# Altium schematic sheet Voltage_sensor_UVW.SchDoc
size 381 x 457 mm
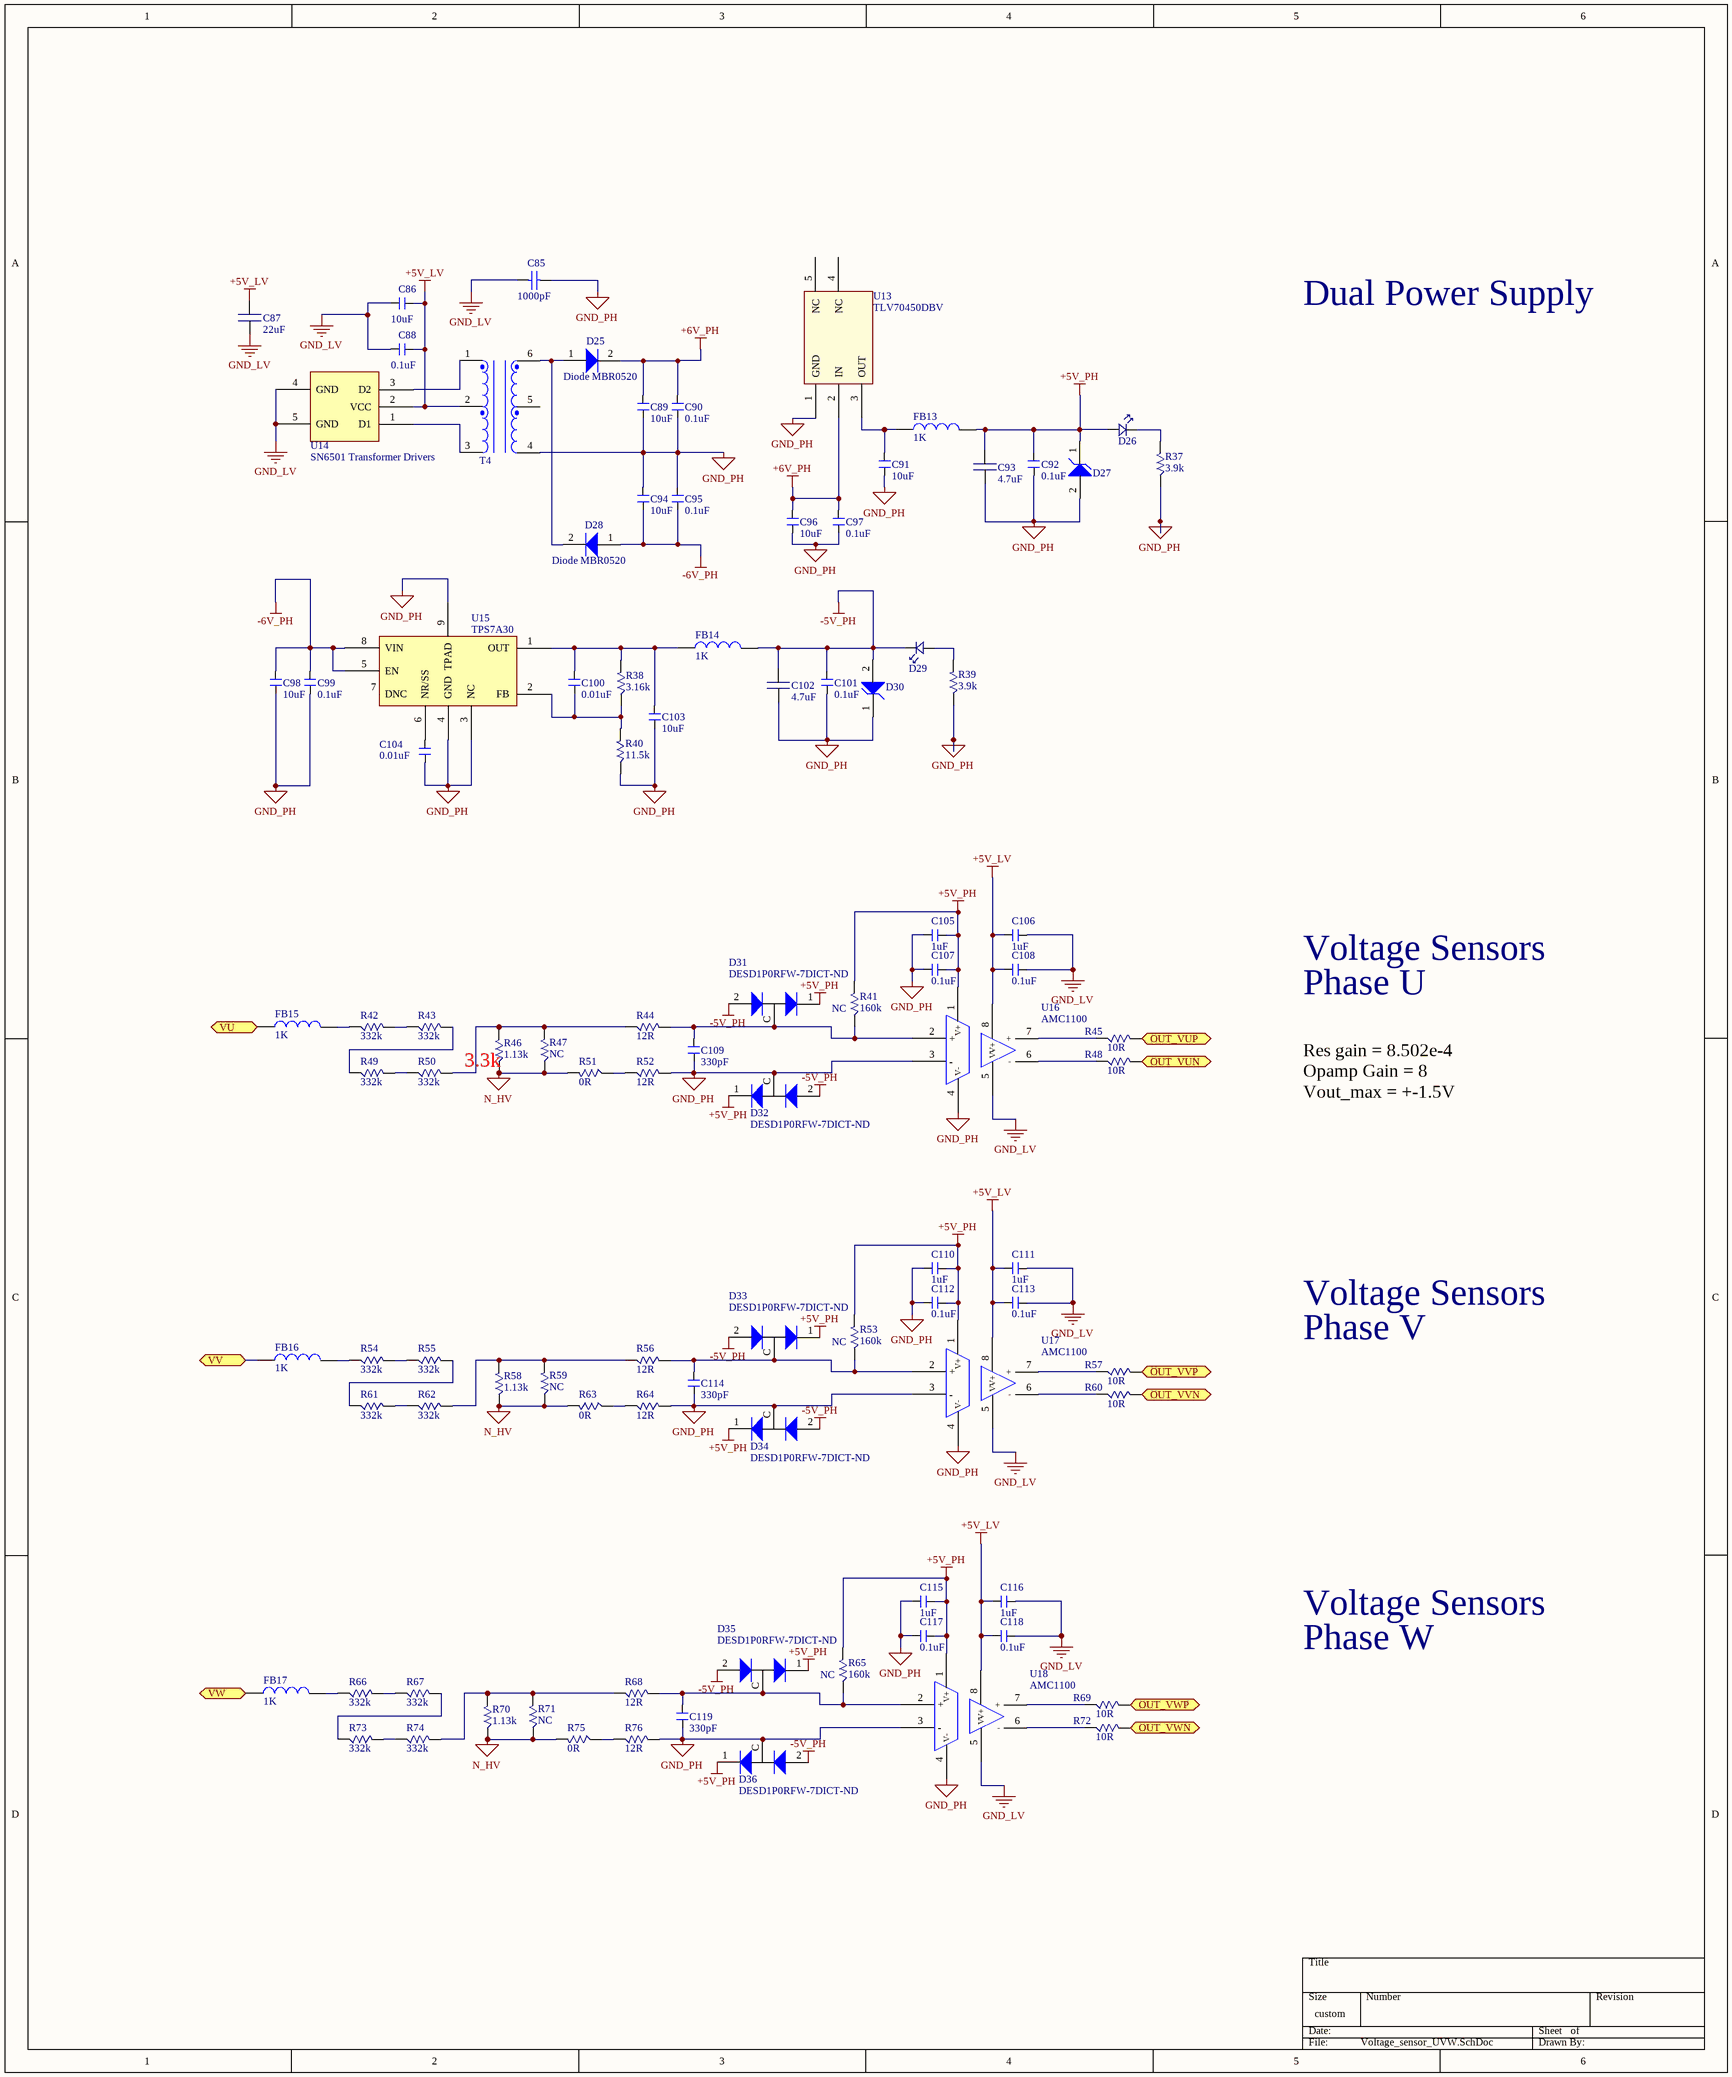
[diagram p0: Voltage_sensor_UVW.SchDoc]

## Parts
C85  value 1000pF  [RAD-0.3]  (hidden comment: Cap TH)
C86  value 10uF  [0603 (1608 Metric)]  (hidden comment: Cap 0603_new)
C87  value 22uF  [0805 (2012 metric)]  (hidden comment: Cap 0805)
C88  value 0.1uF  [0603 (1608 Metric)]  (hidden comment: Cap 0603_new)
C89  value 10uF  [0603 (1608 Metric)]  (hidden comment: Cap 0603_new)
C90  value 0.1uF  [0603 (1608 Metric)]  (hidden comment: Cap 0603_new)
C91  value 10uF  [0603 (1608 Metric)]  (hidden comment: Cap 0603_new)
C92  value 0.1uF  [0603 (1608 Metric)]  (hidden comment: Cap 0603_new)
C93  value 4.7uF  [0805 (2012 metric)]  (hidden comment: Cap 0805)
C94  value 10uF  [0603 (1608 Metric)]  (hidden comment: Cap 0603_new)
C95  value 0.1uF  [0603 (1608 Metric)]  (hidden comment: Cap 0603_new)
C96  value 10uF  [0603 (1608 Metric)]  (hidden comment: Cap 0603_new)
C97  value 0.1uF  [0603 (1608 Metric)]  (hidden comment: Cap 0603_new)
C98  value 10uF  [0603 (1608 Metric)]  (hidden comment: Cap 0603_new)
C99  value 0.1uF  [0603 (1608 Metric)]  (hidden comment: Cap 0603_new)
C100  value 0.01uF  [0603 (1608 Metric)]  (hidden comment: Cap 0603_new)
C101  value 0.1uF  [0603 (1608 Metric)]  (hidden comment: Cap 0603_new)
C102  value 4.7uF  [0805 (2012 metric)]  (hidden comment: Cap 0805)
C103  value 10uF  [0603 (1608 Metric)]  (hidden comment: Cap 0603_new)
C104  value 0.01uF  [0603 (1608 Metric)]  (hidden comment: Cap 0603_new)
C105  value 1uF  [0603 (1608 Metric)]  (hidden comment: Cap 0603_new)
C106  value 1uF  [0603 (1608 Metric)]  (hidden comment: Cap 0603_new)
C107  value 0.1uF  [0603 (1608 Metric)]  (hidden comment: Cap 0603_new)
C108  value 0.1uF  [0603 (1608 Metric)]  (hidden comment: Cap 0603_new)
C109  value 330pF  [0603 (1608 Metric)]  (hidden comment: Cap 0603_new)
C110  value 1uF  [0603 (1608 Metric)]  (hidden comment: Cap 0603_new)
C111  value 1uF  [0603 (1608 Metric)]  (hidden comment: Cap 0603_new)
C112  value 0.1uF  [0603 (1608 Metric)]  (hidden comment: Cap 0603_new)
C113  value 0.1uF  [0603 (1608 Metric)]  (hidden comment: Cap 0603_new)
C114  value 330pF  [0603 (1608 Metric)]  (hidden comment: Cap 0603_new)
C115  value 1uF  [0603 (1608 Metric)]  (hidden comment: Cap 0603_new)
C116  value 1uF  [0603 (1608 Metric)]  (hidden comment: Cap 0603_new)
C117  value 0.1uF  [0603 (1608 Metric)]  (hidden comment: Cap 0603_new)
C118  value 0.1uF  [0603 (1608 Metric)]  (hidden comment: Cap 0603_new)
C119  value 330pF  [0603 (1608 Metric)]  (hidden comment: Cap 0603_new)
D25  Diode MBR0520  [SOD-123]
D26  LED  [0805 (2012 Metric) Diode]  (value not drawn)
D27  *  [POWERDI]  (value not drawn)
D28  Diode MBR0520  [SOD-123]
D29  LED  [0805 (2012 Metric) Diode]  (value not drawn)
D30  *  [POWERDI]  (value not drawn)
D31  Part: DESD1P0RFW-7DICT-ND  [SOT323_ESD]  (hidden comment: TVS - Diodes)
D32  Part: DESD1P0RFW-7DICT-ND  [SOT323_ESD]  (hidden comment: TVS - Diodes)
D33  Part: DESD1P0RFW-7DICT-ND  [SOT323_ESD]  (hidden comment: TVS - Diodes)
D34  Part: DESD1P0RFW-7DICT-ND  [SOT323_ESD]  (hidden comment: TVS - Diodes)
D35  Part: DESD1P0RFW-7DICT-ND  [SOT323_ESD]  (hidden comment: TVS - Diodes)
D36  Part: DESD1P0RFW-7DICT-ND  [SOT323_ESD]  (hidden comment: TVS - Diodes)
FB13  value 1K  [0603 (1608 Metric)]  (hidden comment: Ferrite bead)
FB14  value 1K  [0603 (1608 Metric)]  (hidden comment: Ferrite bead)
FB15  value 1K  [0603 (1608 Metric)]  (hidden comment: Ferrite bead)
FB16  value 1K  [0603 (1608 Metric)]  (hidden comment: Ferrite bead)
FB17  value 1K  [0603 (1608 Metric)]  (hidden comment: Ferrite bead)
R37  value 3.9k  [0603 (1608 Metric)]  (hidden comment: Resistor 0603)
R38  value 3.16k  [0603 (1608 Metric)]  (hidden comment: Resistor 0603)
R39  value 3.9k  [0603 (1608 Metric)]  (hidden comment: Resistor 0603)
R40  value 11.5k  [0603 (1608 Metric)]  (hidden comment: Resistor 0603)
R41  NC  value 160k  [0603 (1608 Metric)]
R42  value 332k  [1206]  (hidden comment: Resistor 1206)
R43  value 332k  [1206]  (hidden comment: Resistor 1206)
R44  value 12R  [1206]  (hidden comment: Resistor 1206)
R45  value 10R  [0603 (1608 Metric)]  (hidden comment: Resistor 0603)
R46  value 1.13k  [1206]  (hidden comment: Resistor 1206)
R47  value NC  [1206]  (hidden comment: Resistor 1206)
R48  value 10R  [0603 (1608 Metric)]  (hidden comment: Resistor 0603)
R49  value 332k  [1206]  (hidden comment: Resistor 1206)
R50  value 332k  [1206]  (hidden comment: Resistor 1206)
R51  value 0R  [0603 (1608 Metric)]  (hidden comment: Resistor 0603)
R52  value 12R  [1206]  (hidden comment: Resistor 1206)
R53  NC  value 160k  [0603 (1608 Metric)]
R54  value 332k  [1206]  (hidden comment: Resistor 1206)
R55  value 332k  [1206]  (hidden comment: Resistor 1206)
R56  value 12R  [1206]  (hidden comment: Resistor 1206)
R57  value 10R  [0603 (1608 Metric)]  (hidden comment: Resistor 0603)
R58  value 1.13k  [1206]  (hidden comment: Resistor 1206)
R59  value NC  [1206]  (hidden comment: Resistor 1206)
R60  value 10R  [0603 (1608 Metric)]  (hidden comment: Resistor 0603)
R61  value 332k  [1206]  (hidden comment: Resistor 1206)
R62  value 332k  [1206]  (hidden comment: Resistor 1206)
R63  value 0R  [0603 (1608 Metric)]  (hidden comment: Resistor 0603)
R64  value 12R  [1206]  (hidden comment: Resistor 1206)
R65  NC  value 160k  [0603 (1608 Metric)]
R66  value 332k  [1206]  (hidden comment: Resistor 1206)
R67  value 332k  [1206]  (hidden comment: Resistor 1206)
R68  value 12R  [1206]  (hidden comment: Resistor 1206)
R69  value 10R  [0603 (1608 Metric)]  (hidden comment: Resistor 0603)
R70  value 1.13k  [1206]  (hidden comment: Resistor 1206)
R71  value NC  [1206]  (hidden comment: Resistor 1206)
R72  value 10R  [0603 (1608 Metric)]  (hidden comment: Resistor 0603)
R73  value 332k  [1206]  (hidden comment: Resistor 1206)
R74  value 332k  [1206]  (hidden comment: Resistor 1206)
R75  value 0R  [0603 (1608 Metric)]  (hidden comment: Resistor 0603)
R76  value 12R  [1206]  (hidden comment: Resistor 1206)
T4  750313769  [Xmr SN6501]  (value not drawn)
U13  TLV70450DBV  [SOT23-5]
U14  SN6501 Transformer Drivers  [SOT23-5]
U15  TPS7A30  [8-TSSOP]
U16  AMC1100  [SOIC8]
U17  AMC1100  [SOIC8]
U18  AMC1100  [SOIC8]

## Ports
OUT_VUN, OUT_VUP, OUT_VVN, OUT_VVP, OUT_VWN, OUT_VWP, VU, VV, VW

## Nets
+5V_LV: C86.2(OUT) C87.2(OUT) C88.2(OUT) C106.1(OUT) C108.1(OUT) C111.1(OUT) C113.1(OUT) C116.1(OUT) C118.1(OUT) T4.2 U14.2(VCC) U16.8(V+) U17.8(V+) U18.8(V+)
+5V_PH: C92.2(OUT) C93.2(OUT) C105.2(OUT) C107.2(OUT) C110.2(OUT) C112.2(OUT) C115.2(OUT) C117.2(OUT) D26.A D27.1(Anode) D31.1(Anode) D32.1(Anode) D33.1(Anode) D34.1(Anode) D35.1(Anode) D36.1(Anode) FB13.2(OUT) R41.2(A) R53.2(A) R65.2(A) U16.1(V+) U17.1(V+) U18.1(V+)
+6V_PH: C89.2(OUT) C90.2(OUT) C96.2(OUT) C97.2(OUT) D25.2(Anode) U13.2(IN)
-5V_PH: C101.2(OUT) C102.2(OUT) D29.K D30.2(Anode) D31.2(Anode) D32.2(Anode) D33.2(Anode) D34.2(Anode) D35.2(Anode) D36.2(Anode) FB14.2(OUT)
-6V_PH: C94.1(OUT) C95.1(OUT) C98.2(OUT) C99.2(OUT) D28.1(Anode) U15.5(EN) U15.8(VIN)
GND_LV: C85.1 C86.1(OUT) C87.1(OUT) C88.1(OUT) C106.2(OUT) C108.2(OUT) C111.2(OUT) C113.2(OUT) C116.2(OUT) C118.2(OUT) U14.4(GND) U14.5(GND) U16.5(V-) U17.5(V-) U18.5(V-)
GND_PH: C85.2 C89.1(OUT) C90.1(OUT) C91.1(OUT) C92.1(OUT) C93.1(OUT) C94.2(OUT) C95.2(OUT) C96.1(OUT) C97.1(OUT) C98.1(OUT) C99.1(OUT) C101.1(OUT) C102.1(OUT) C103.1(OUT) C104.1(OUT) C105.1(OUT) C107.1(OUT) C109.2(OUT) C110.1(OUT) C112.1(OUT) C114.2(OUT) C115.1(OUT) C117.1(OUT) C119.2(OUT) D27.2(Anode) D30.1(Anode) D32.C(Cathode) D34.C(Cathode) D36.C(Cathode) R37.1(A) R39.1(A) R40.1(A) R52.2(A) R64.2(A) R76.2(A) T4.4 U13.1(GND) U15.3(NC) U15.4(GND) U15.9(TPAD) U16.3(-) U16.4(V-) U17.3(-) U17.4(V-) U18.3(-) U18.4(V-)
N_HV: R46.1(A) R47.1(A) R51.2(A) R58.1(A) R59.1(A) R63.2(A) R70.1(A) R71.1(A) R75.2(A)
OUT_VUN: R48.2(A) ; port OUT_VUN
OUT_VUP: R45.2(A) ; port OUT_VUP
OUT_VVN: R60.2(A) ; port OUT_VVN
OUT_VVP: R57.2(A) ; port OUT_VVP
OUT_VWN: R72.2(A) ; port OUT_VWN
OUT_VWP: R69.2(A) ; port OUT_VWP
VU: FB15.1(OUT) ; port VU
VV: FB16.1(OUT) ; port VV
VW: FB17.1(OUT) ; port VW
NetC91_2: C91.2(OUT) FB13.1(OUT) U13.3(OUT)
NetC100_1: C100.1(OUT) C103.2(OUT) FB14.1(OUT) R38.2(A) U15.1(OUT)
NetC100_2: C100.2(OUT) R38.1(A) R40.2(A) U15.2(FB)
NetC104_2: C104.2(OUT) U15.6(NR/SS)
NetC109_1: C109.1(OUT) D31.C(Cathode) R41.1(A) R44.2(A) U16.2(+)
NetC114_1: C114.1(OUT) D33.C(Cathode) R53.1(A) R56.2(A) U17.2(+)
NetC119_1: C119.1(OUT) D35.C(Cathode) R65.1(A) R68.2(A) U18.2(+)
NetD25_1: D25.1(Anode) D28.2(Anode) T4.6
NetD26_K: D26.K R37.2(A)
NetD29_A: D29.A R39.2(A)
NetFB15_2: FB15.2(OUT) R42.1(A)
NetFB16_2: FB16.2(OUT) R54.1(A)
NetFB17_2: FB17.2(OUT) R66.1(A)
NetR42_2: R42.2(A) R43.1(A)
NetR43_2: R43.2(A) R49.1(A)
NetR44_1: R44.1(A) R46.2(A) R47.2(A) R50.2(A)
NetR45_1: R45.1(A) U16.7(+)
NetR48_1: R48.1(A) U16.6(-)
NetR49_2: R49.2(A) R50.1(A)
NetR51_1: R51.1(A) R52.1(A)
NetR54_2: R54.2(A) R55.1(A)
NetR55_2: R55.2(A) R61.1(A)
NetR56_1: R56.1(A) R58.2(A) R59.2(A) R62.2(A)
NetR57_1: R57.1(A) U17.7(+)
NetR60_1: R60.1(A) U17.6(-)
NetR61_2: R61.2(A) R62.1(A)
NetR63_1: R63.1(A) R64.1(A)
NetR66_2: R66.2(A) R67.1(A)
NetR67_2: R67.2(A) R73.1(A)
NetR68_1: R68.1(A) R70.2(A) R71.2(A) R74.2(A)
NetR69_1: R69.1(A) U18.7(+)
NetR72_1: R72.1(A) U18.6(-)
NetR73_2: R73.2(A) R74.1(A)
NetR75_1: R75.1(A) R76.1(A)
NetT4_1: T4.1 U14.3(D2)
NetT4_3: T4.3 U14.1(D1)

Not connected (* = marked no-connect by the designer): T4 5(1); U13 4(NC) 5(NC); U15 7(DNC)

## Notes on the sheet
- Dual Power Supply
- Voltage Sensors
- Phase U
- (near R46) 3.3k
- Res gain = 8.502e-4
  Opamp Gain = 8
  Vout_max = +-1.5V
  Maximum Voltage= +- 220.5
- Phase V
- Phase W

## Library data of the parts
C85 = Cap: CAP CER 1000PF 1KV Y5P RADIAL; Part: 1251PH-ND; Published: 8-Jun-2000; LatestRevisionDate: 17-Jul-2002; LatestRevisionNote: Re-released for DXP Platform.; PackageReference: RAD-0.3; Publisher: Altium Limited; PackageDescription: Radial Cap, Thru-Hole; 2 Leads; 0.3 in Pin Spacing
C86 C89 C91 C94 C96 C98 C103 = Cap 0603_new: CAP CER 10UF 35V X5R 0805; part: 490-10515-1-ND
C87 = Cap 0805: CAP CER 22UF 35V X5R 0805; Part: 445-14428-1-ND
C88 C90 C92 C95 C97 C99 C101 C107 C108 C112 C113 C117 C118 = Cap 0603_new: CAP CER 0.1UF 50V Y5V 0603; part: 311-1343-6-ND
C93 C102 = Cap 0805: CAP CER 4.7UF 50V X5R 0805; Part: 445-5980-1-ND
C100 C104 = Cap 0603_new: CAP CER 10000PF 100V X7R 0603; part: 478-7418-1-ND
C105 C106 C110 C111 C115 C116 = Cap 0603_new: CAP CER 1UF 50V X5R 0603; part: 1276-1860-1-ND
C109 C114 C119 = Cap 0603_new: CAP CER 330PF 50V C0G 0603; part: 445-7033-2-ND
D25 D28 = Diode MBR0520: DIODE SCHOTTKY 20V 500MA SOD123; Part: MBR0520LT1GOSCT-ND; Value: *
D26 D29 = LED: LED 0805
D27 D30 = Diode Zener POWERDI123: Part: MMSZ5228B-FDICT-ND; Value: *
D31-D36 = Diode_ESD: TVS DIODE 70VWM 8VC SOT323; Value: ESD
FB13-FB17 = Ferrite bead: FERRITE BEAD 1 KOHM 0603 1LN; Part: 445-8672-1-ND
R37 R39 = Resistor 0603: RES SMD 3.9K OHM 5% 1/10W 0603; Part: 541-3.9KGCT-ND
R38 = Resistor 0603: RES SMD 3.16K OHM 1% 1/10W 0603; Part: 311-3.16KHRCT-ND
R40 = Resistor 0603: RES SMD 11.5K OHM 1% 1/10W 0603; Part: 541-11.5KHCT-ND
R41 R53 R65 = Resistor 0603
R42 R43 R49 R50 R54 R55 R61 R62 R66 R67 R73 R74 = Resistor 1206: RES SMD 332K OHM 0.1% 1/4W 1206; Part: RG32P332KBCT-ND
R44 R52 R56 R64 R68 R76 = Resistor 1206: 12 Ohm ±0.5% 0.25W, 1/4W Chip Resistor 1206; Part: 311-2961-1-ND
R45 R48 R57 R60 R69 R72 = Resistor 0603: RES SMD 10 OHM 0.05% 1/10W 0603; Part: RNCF0603AKT10R0CT-ND
R46 R58 R70 = Resistor 1206: RES SMD 1.13K OHM 0.1% 1/4W 1206; Part: P1.13KBCCT-ND
T4 = 750313769: TRANSFORMER SMD TR1.7 SN6501; Part: 1297-1107-1-ND
U13 = TLV70450DBV: IC REG LDO 5V 0.15A SOT23-5; Part: 296-39287-1-ND
U14 = SN6501: IC REG CONV PWR SUPPLIES SOT23-5; Part: 296-37700-1-ND; Value: *
U15 = TPS7A30: IC REG LDO NEG ADJ 0.2A 8MSOP; Part: 296-27750-1-ND
U16-U18 = AMC1100: IC OPAMP ISOLATION 100KHZ 8SOIC; Part: 296-38822-5-ND